# EAGLE design REV001 (EAGLE 7.7.0)
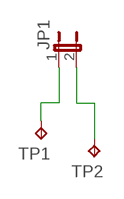
[diagram p0: schematic, sheet 1]

## Parts
JP1  JP1E  [JP1]
TP1  TPTP06SQ  [TP06SQ]
TP2  TPTP06SQ  [TP06SQ]

## Nets
1: JP1.1 TP1.TP
2: JP1.2 TP2.TP

## Library data of the parts
JP1 = jumper:JP1E: JUMPER
TP1 TP2 = testpad:TP: Test pad

## Board
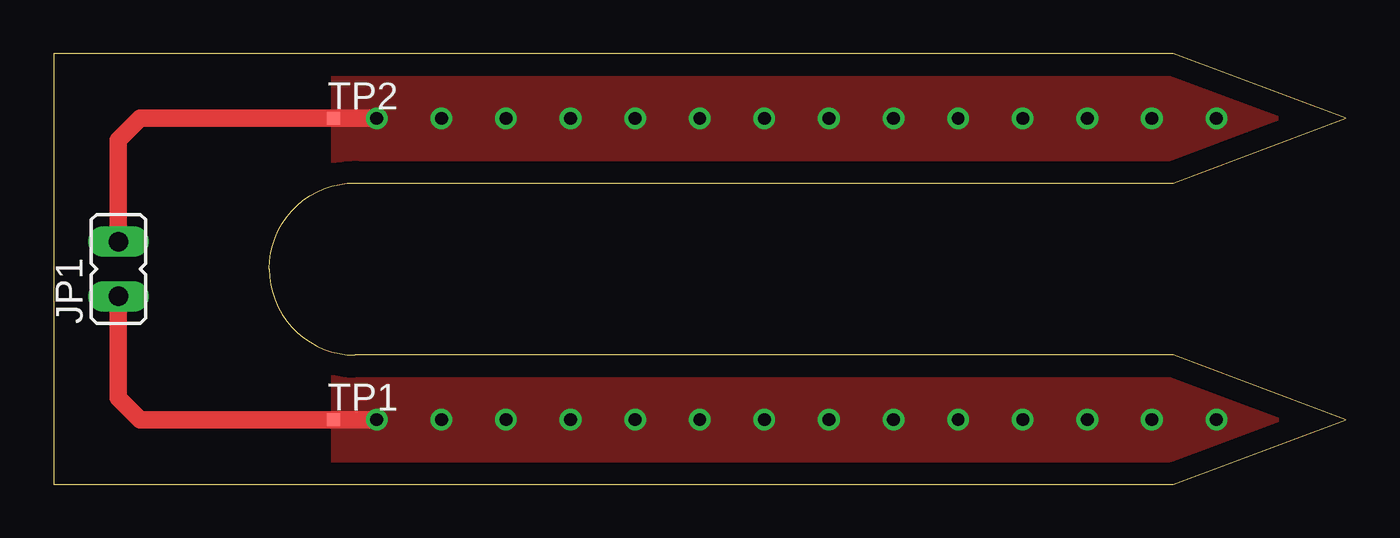
[diagram p1: board, top side]
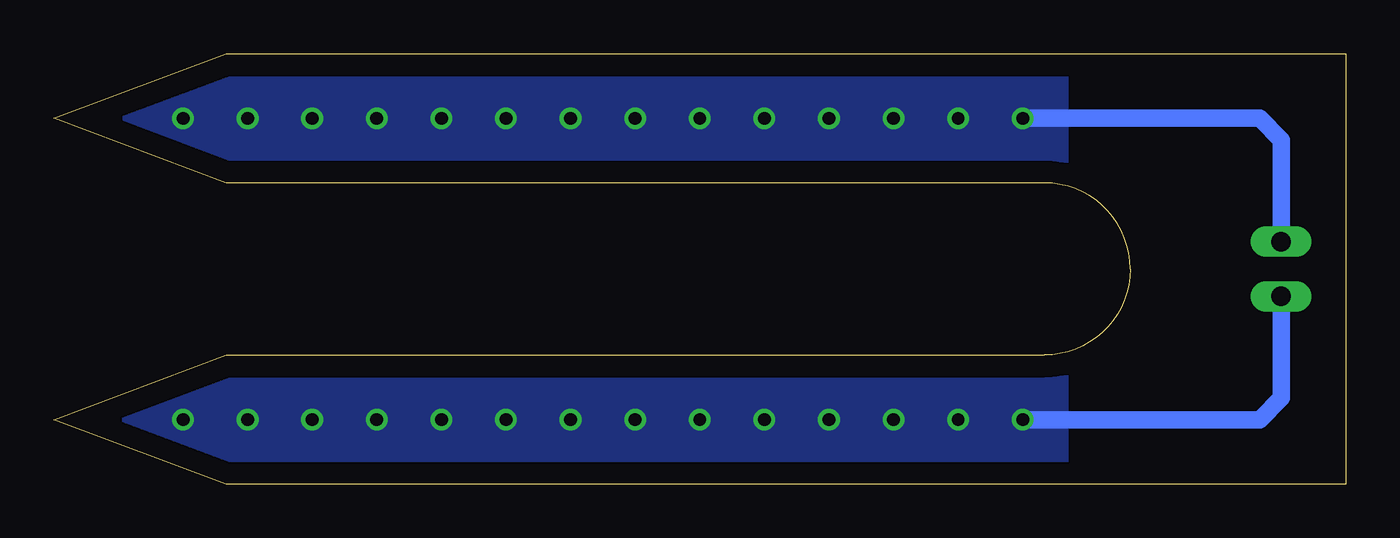
[diagram p2: board, bottom side, seen from below]

Size 60 x 20 mm. Coordinates in mm from the lower left corner, seen from the top.
Outline: 0,0 52,0 60,3 52,6 14,6 arc-90 10,10 arc-90 14,14 52,14 60,17 52,20 0,20 0,0
Copper layers (1*16): Top 0.035mm / dielectric 1.5mm / Bottom 0.035mm
Design rules "default": minimum track width 10mil, minimum drill 24mil, track to track 8mil, track to pad 8mil, pad to pad 8mil, via to via 8mil, smd to smd 8mil, copper to edge 40mil, drill to drill 8mil, minimum pad ring 10mil, minimum via ring 8mil, stop-mask expansion 4mil, vias tented up to drill 0mil, thermal gap 10mil

### Footprints (pad centres in the part's own frame; a part is rotated, then mirrored left to right if it is on the bottom)
JP1 = drill 0.914 long: 1 0,-1.27; 2 0,1.27
TP06SQ = smd 0.6 x 0.6: TP 0,0

### Placement (x,y rotation side)
JP1  3,10 0 top
TP1  13,3 0 top
TP2  13,17 0 top

### Tracks (layer width: path | path; a pad name or v marks a point on that pad's centre or on a via)
1  (via drill 0.6)
  Top 0.813: JP1.1 3,4 4,3 v15,3
  Bottom 0.813: JP1.1 3,4 4,3 v15,3
  other vias: 18,3 21,3 24,3 27,3 30,3 33,3 36,3 39,3 42,3 45,3 48,3 51,3 54,3
  pour Bottom (no thermals): 13,5 52,5 58,3 52,1 13,1
  pour Top (no thermals): 13,5 52,5 58,3 52,1 13,1
2  (via drill 0.6)
  Top 0.813: JP1.2 3,16 4,17 v15,17
  Bottom 0.813: JP1.2 3,16 4,17 v15,17
  other vias: 18,17 21,17 24,17 27,17 30,17 33,17 36,17 39,17 42,17 45,17 48,17 51,17 54,17
  pour Bottom (no thermals): 13,19 52,19 58,17 52,15 13,15
  pour Top (no thermals): 13,19 52,19 58,17 52,15 13,15